# EAGLE design Adafruit USB Type C PD Switchable (EAGLE 9.6.2)
COMPANY: ADAFRUIT INDUSTRIES; DRAWN: KTOWN; REV: A; YEAR: 2019
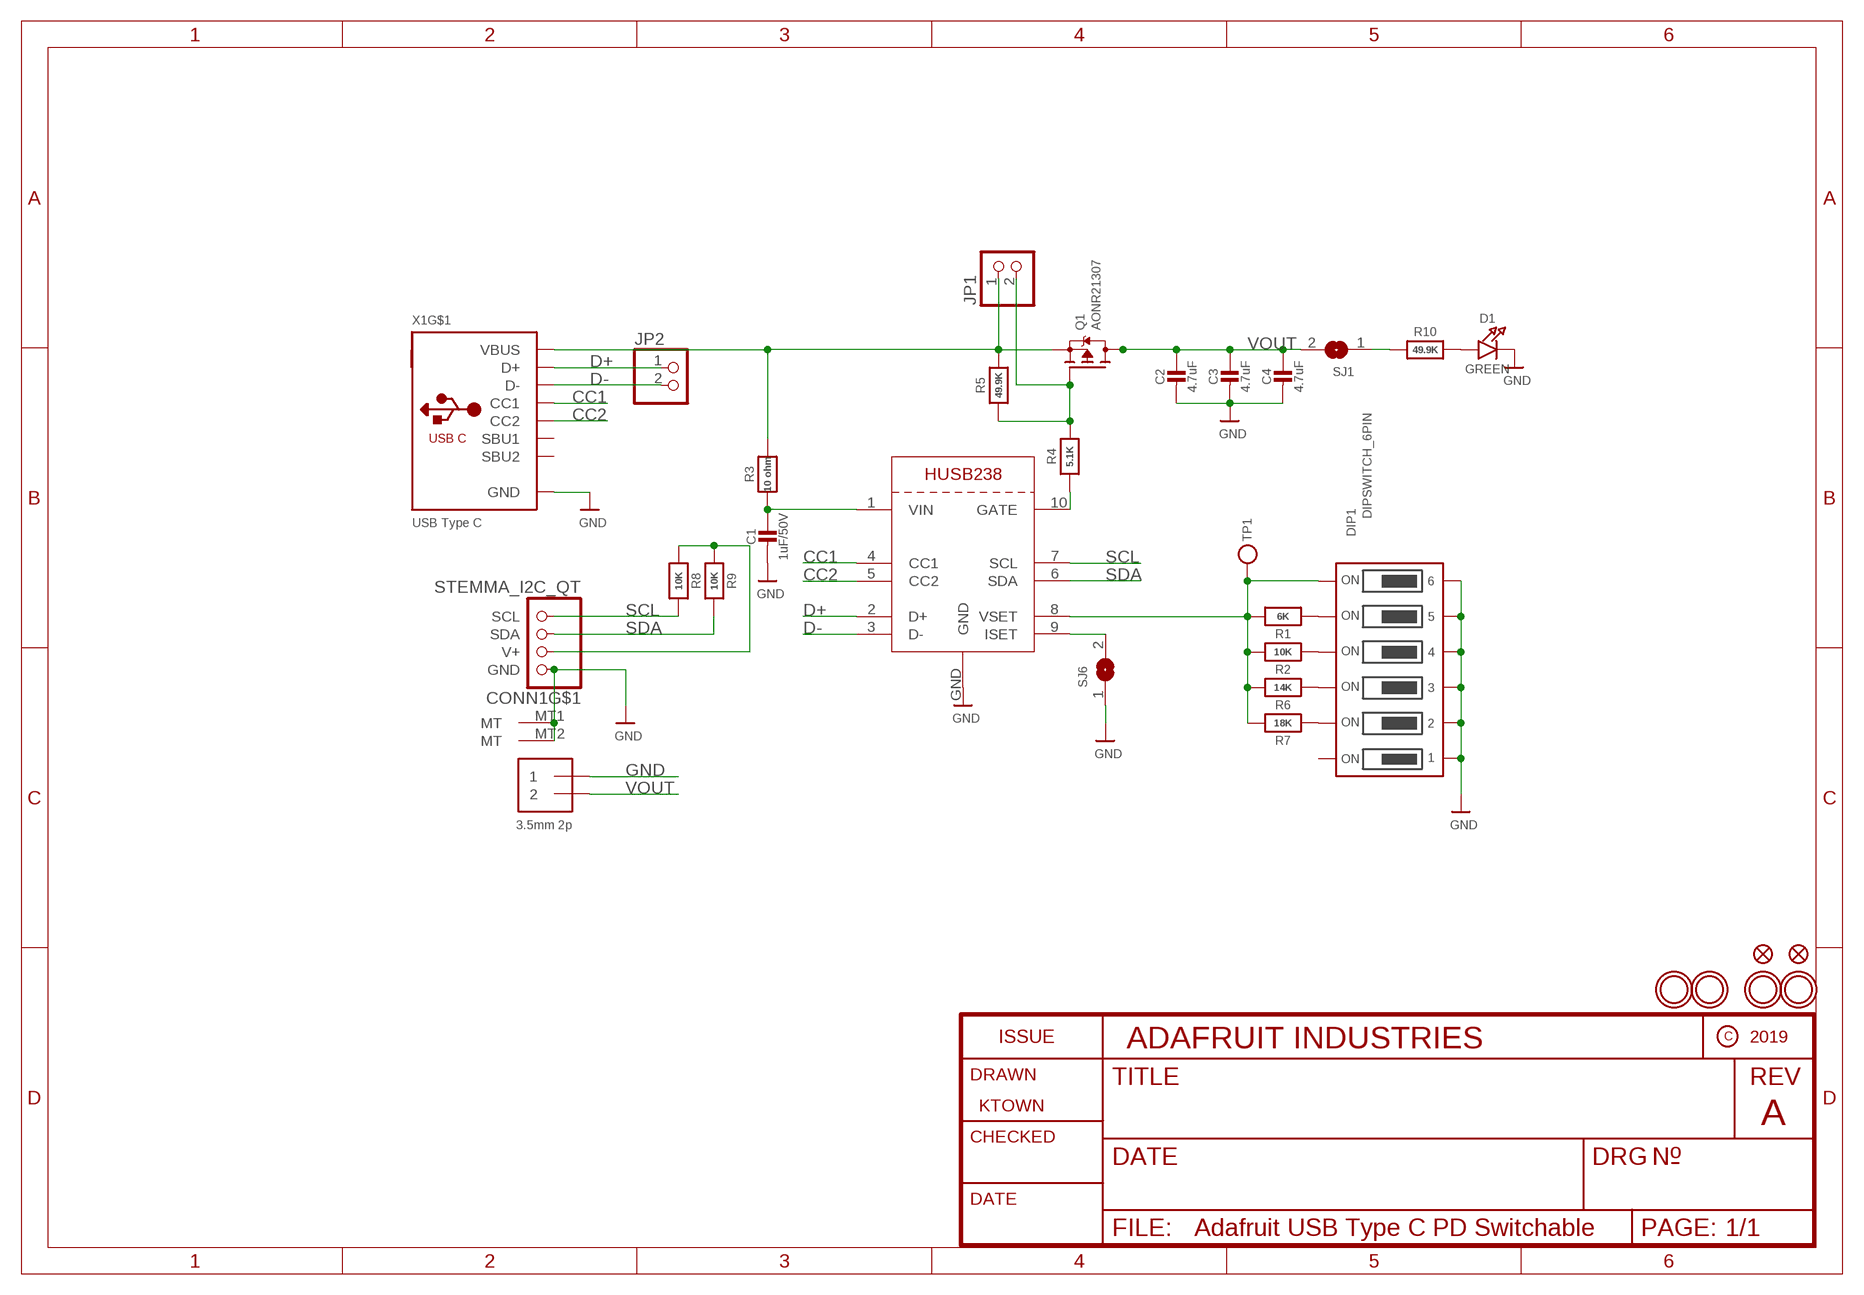
[diagram p0: schematic, sheet 1]

## Parts
C1  1uF/50V  CAP_CERAMIC0805-NOOUTLINE  [0805-NO]
C2  4.7uF  CAP_CERAMIC0805-NOOUTLINE  [0805-NO]
C3  4.7uF  CAP_CERAMIC0805-NOOUTLINE  [0805-NO]
C4  4.7uF  CAP_CERAMIC0805-NOOUTLINE  [0805-NO]
CONN1  STEMMA_I2C_QT  [JST_SH4]
D1  GREEN  LED0603_NOOUTLINE  [CHIPLED_0603_NOOUTLINE]
DIP1  DIPSWITCH_6PIN  [DIPSWITCH_6PIN_1.27]
FID1  FIDUCIAL_1MM  [FIDUCIAL_1MM]
FID2  FIDUCIAL_1MM  [FIDUCIAL_1MM]
JP1  HEADER-1X2ROUND  [1X02_ROUND]
JP2  HEADER-1X2ROUND  [1X02_ROUND]
Q1  AONR21307  MOSFET-P-POWERDI3333  [POWERDI3333]
R1  6K  RESISTOR_0402NO  [_0402NO]
R2  10K  RESISTOR_0402NO  [_0402NO]
R3  10 ohm  RESISTOR_0402NO  [_0402NO]
R4  5.1K  RESISTOR_0402NO  [_0402NO]
R5  49.9K  RESISTOR_0402NO  [_0402NO]
R6  14K  RESISTOR_0402NO  [_0402NO]
R7  18K  RESISTOR_0402NO  [_0402NO]
R8  10K  RESISTOR_0402NO  [_0402NO]
R9  10K  RESISTOR_0402NO  [_0402NO]
R10  49.9K  RESISTOR_0402NO  [_0402NO]
SJ1  SOLDERJUMPERCLOSED  [SOLDERJUMPER_CLOSEDWIRE]
SJ6  SOLDERJUMPERCLOSED  [SOLDERJUMPER_CLOSEDWIRE]
TP1  TESTPOINTROUND1.5MMNO  [TESTPOINT_ROUND_1.5MM_NO]
U$1  MOUNTINGHOLE2.5  [MOUNTINGHOLE_2.5_PLATED]
U$2  MOUNTINGHOLE2.5  [MOUNTINGHOLE_2.5_PLATED]
U$13  MOUNTINGHOLE2.5  [MOUNTINGHOLE_2.5_PLATED]
U$16  MOUNTINGHOLE2.5  [MOUNTINGHOLE_2.5_PLATED]
X1  USB Type C  USB_C  [USB_C_CUSB31-CFM2AX-01-X]
X3  HUSB238  [DFN10_3X3MM]
X4  3.5mm 2p  TERMBLOCK_1X2_3.5MM  [TERMBLOCK_1X2-3.5MM]

## Nets
CC1: X1.A5(CC1) X3.4(CC1)
CC2: X1.B5(CC2) X3.5(CC2)
D+: JP2.1 X1.A6(D+) X1.B6(D+) X3.2(D+)
D-: JP2.2 X1.A7(D-) X1.B7(D-) X3.3(D-)
GND: C1.2 C2.2 C3.2 C4.2 CONN1.1(GND) CONN1.MT1(MT) CONN1.MT2(MT) D1.C DIP1.1OFF DIP1.2OFF DIP1.3OFF DIP1.4OFF DIP1.5OFF DIP1.6OFF SJ6.1 X1.A1B12(GND) X1.B1A12(GND) X3.GND X4.1
N$1: C1.1 R3.1 X3.1(VIN)
N$2: JP1.2 Q1.4(G) R4.2 R5.2
N$3: DIP1.6ON R1.2 R2.2 R6.2 R7.2 TP1.P$1 X3.8(VSET)
N$4: R4.1 X3.10(GATE)
N$5: DIP1.5ON R1.1
N$6: DIP1.4ON R2.1
N$7: DIP1.3ON R6.1
N$8: DIP1.2ON R7.1
N$9: SJ6.2 X3.9(ISET)
N$10: CONN1.2(V+) R8.1 R9.1
N$11: R10.1 SJ1.1
N$12: D1.A R10.2
SCL: CONN1.4(SCL) R8.2 X3.7(SCL)
SDA: CONN1.3(SDA) R9.2 X3.6(SDA)
VBUS: JP1.1 Q1.1(S) Q1.2(S) Q1.3(S) R3.2 R5.1 X1.A4B9(VBUS) X1.B4A9(VBUS)
VOUT: C2.1 C3.1 C4.1 Q1.5678(D) SJ1.2 X4.2
Unconnected: DIP1.1ON X1.A8(SBU1) X1.B8(SBU2) X1.M1(MT) X1.M2(MT) X1.M3(MT) X1.M4(MT)

## Library data of the parts
C1-C4 = microbuilder:CAP_CERAMIC: Ceramic Capacitors For new designs, use the packages preceded by an '_' character since they are more reliable: The following footprints should be used on most boards: _0402 - Standard footprint for regular board layouts _0603 - Standard footprint for regular board layouts _0805 - Standard footprint for regular board layouts _1206 - Standard footprint for regular board layouts For extremely tight-pitch boards where space is at a premium, the following 'micro-pitch' footprints can be used (smaller pads, no silkscreen outline, etc.): _0402MP - Micro-pitch footprint for very dense/compact boards _0603MP - Micro-pitch footprint for very dense/compact boards _0805MP - Micro-pitch footprint for very dense/compact boards _1206MP - Micro-pitch footprint for very dense/compact boards
CONN1 = adafruit_electromech:STEMMA_I2C; LCSC: C2845363
D1 = microbuilder:LED: LED 0603 - 0603 Surface Mount Package 2mA: Green LED - Low Power (3.9mcd, 2ma, 1.7Vf) - Digikey: 475-2709-2-ND Orange LED - Low Power (9.8mcd, 2ma, 1.8Vf) - Digikey: 475-1194-2-ND Red LED - Low Power (5mcd, 2ma, 1.8Vf) - Digikey: 475-1195-2-ND Yellow LED - Low Power (7mcd, 2ma, 1.8Vf) - Digikey: 475-1196-2-ND 5mA: Blue LED - Low Power (17mcd, 5ma, 2.9Vf) - Digikey: LNJ937W8CRACT-ND 0805 - 0805 Surface Mount Package 2mA: Red LED (8.8mcd, 2mA, 1.8Vf, Clear) - Low Power [Digikey: 475-2510-1-ND] Green LED (5mcd, 2mA, 1.8Vf, Clear) - Low Power [Digikey: 475-2730-1-ND] Yellow LED (11.3mcd, 2mA, 1.8Vf, Clear) - Low Power [Digikey: 475-2555-1-ND] 20mA: Red LED (104mcd, 20mA, Diffused) - LS R976 [Digikey: 475-1278-6-ND] Red LED (12mcd, 20mA, 2.0Vf, Clear) - APT2012EC [Digikey: 754-1128-1-ND] Green LED (15mcd, 20mA, 2.2Vf, Clear) - APT2012GC [Digikey: 754-1131-1-ND] Orange LED (160mcd, 20mA, 2.1Vf, Clear) - APT2012SECK [Digikey: 754-1130-1-ND] 1206 - 1206 Surface Mount Package Green LED (26mcd, 20mA, Diffused) - LG N971 [Digikey: 475-1407-6-ND] Red LED (15mcd, 20mA, Diffused) - LH N974 [Digikey: 475-1416-6-ND] Cree - Cree High-Power Surface Mount LEDs XPEBWT-L1-0000-00D50 - White 111lm 350mA 2.9Vf 6200K 110° XTEAWT-00-0000-00000LEE3 - White 114lm 350mA 2.85Vf 5000K 115° Everlight - Everlight 45-21 Series Surface Mount LEDs 45-21/QK2C-B2832AC2CB2/2T - Warm White 2000mcd 20mA 3.25Vf 3050K 120° 45-21/LK2C-B38452C4CB2/2T - Nuetral White 2000mcd 20mA 3.25Vf 4150K 120° 45-21/LK2C-B50634C6CB2/2T - Cold White 2200mcd 20mA 3.25Vf 5650K 120° PLCC2 Reverse Mount LS T77K-J1L2-1-0-2-R18-Z - Red 11.25mcd 2mA 1.8Vf 630nm 120° LO T77K-L1M2-24-Z - Orange 19.6mcd 2mA 1.8Vf 606nm 120° LY T77K-K2M1-26-Z - Yellow 15.7mcd 2mA 1.8Vf 587nm 120°; ROT: 270
DIP1 = adafruit_electromech:DIPSWITCH_6PIN
FID1 FID2 = microbuilder:FIDUCIAL: Fiducial Alignment Points Various fiducial points for machine vision alignment.; BOM: EXCLUDE
JP1 JP2 = microbuilder:HEADER-1X2: PIN HEADER
Q1 = microbuilder:MOSFET-P: P-Channel Mosfet LEGEND VDS: Voltage Drain-Source ID: Drain Current RDS(ON): Drain-Source On-State Resistance VGS(TH): Gate-Source Threshold Voltage CISS: Drain-Source Input Capacitance SOT-23 Name VDS ID RDS(ON) VGS(TH) CISS Order Number IRLML5103 30V 760mA 600 mOhm -- 75pF @ 25V Digikey: IRLML5103PBFCT-ND IRLML6401 12V 4.3A 50 mOhm 950mV @ 250µA 830pF @ 10V Digikey: IRLML6401PBFTR-ND NTR0202PL 20V 400mA 800 mOhm 2.3V @ 250uA 70pF @ 5V Digikey: NTR0202PLT1GOSTR-ND NTR4101PT1G 20V 1.8A 85 mOhm 1.2V @ 250uA 675pF @ 10V Digikey: NTR4101PT1GOSCT-ND DMP2004K 20V 600mA 900 mOhm 1V @ 250uA 175pF @ 16V Digikey: DMP2004KDICT-ND PMV65XP 20V 3.9A 76 mOhm 950mV @ 1mA 725pF @ 20V Digikey: 568-2358-2-ND TO-252 Name VDS ID RDS(ON) VGS(TH) CISS Order Number AOD417 30V 25A 34 mOhm 3V @ 250µA 920pF @ 15V Digikey: 785-1106-2-ND PowerPak Name VDS ID RDS(ON) VGS(TH) CISS Order Number AON7401 30V 12A 14 mOhm 3V @ 250µA 2600pF @ 15V Digikey: 785-1302-1-ND; ROT: 270
R1-R10 = microbuilder:RESISTOR: Resistors For new designs, use the packages preceded by an '_' character since they are more reliable: The following footprints should be used on most boards: _0402 - Standard footprint for regular board layouts _0603 - Standard footprint for regular board layouts _0805 - Standard footprint for regular board layouts _1206 - Standard footprint for regular board layouts For extremely tight-pitch boards where space is at a premium, the following 'micro-pitch' footprints can be used (smaller pads, no silkscreen outline, etc.): _0402MP - Micro-pitch footprint for very dense/compact boards _0603MP - Micro-pitch footprint for very dense/compact boards _0805MP - Micro-pitch footprint for very dense/compact boards _1206MP - Micro-pitch footprint for very dense/compact boards
SJ1 SJ6 = microbuilder:SOLDERJUMPER: SMD Solder JUMPER Solder the two pads together to create a connection, or remove the solder to break it. REFLOW - Use this footprint for solder paste and reflow ovens. WAVE - Use this footprint for hand-soldering (larger pads). CLOSED - Has a trace between the two pads to ensure it is closed by default. The trace needs to be cut to disable the jumper, and can be closed again by creating a solder bridge between the two pads.
TP1 = microbuilder:TESTPOINT: Test Point Various test points for characterisation and PCB testing TESTPOINT_SMT - Compact Surface Mount Test Point [Digikey: 5016KTR-ND]
U$1 U$2 U$13 U$16 = adafruit_electromech:MOUNTINGHOLE: Mounting Hole For #2 screws (0.086"/2.18mm width, 0.094"/2.4mm hole) use 2.5mm; BOM: EXCLUDE
X1 = adafruit_electromech:USB_C: USB Type-C USB 2.0 Connector; LCSC: C165948
X3 = adafruit_power:HUSB238
X4 = adafruit_electromech:TERMBLOCK_1X2: 3.5mm Terminal block http://www.ladyada.net/library/pcb/eaglelibrary.html; ROT: 0

## Board
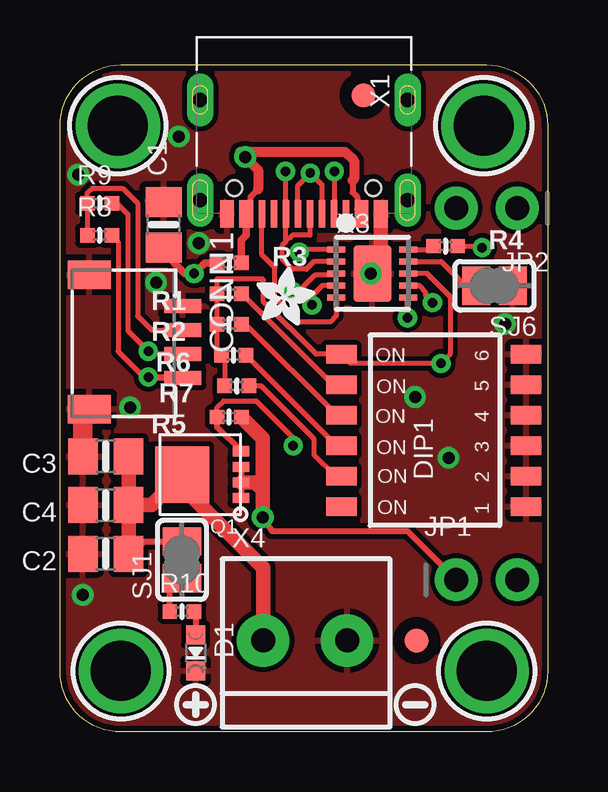
[diagram p1: board, top side]
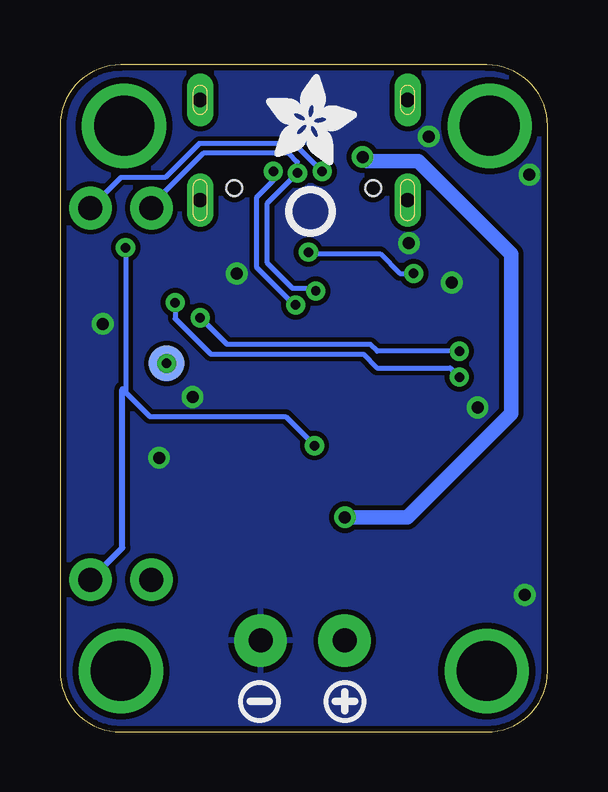
[diagram p2: board, bottom side, seen from below]

Size 20.32 x 27.81 mm. Coordinates in mm from the lower left corner, seen from the top.
Outline: 20.32,25.27 20.32,2.54 arc-90 17.78,0 2.54,0 arc-90 0,2.54 0,25.27 arc-90 2.54,27.81 17.78,27.81 arc-90 20.32,25.27
Copper layers (1*16): Top 0.035mm / dielectric 1.5mm / Bottom 0.035mm
Design rules "adafruit": minimum track width 8mil, minimum drill 15.5mil, track to track 8mil, track to pad 8mil, pad to pad 8mil, via to via 8mil, smd to smd 8mil, copper to edge 10mil, drill to drill 8mil, minimum pad ring 10mil, minimum via ring 8mil, stop-mask expansion 2mil, vias tented up to drill 20mil, thermal gap 10mil

### Footprints (pad centres in the part's own frame; a part is rotated, then mirrored left to right if it is on the bottom)
0805-NO = smd 1.24 x 1.5: 1 -0.95,0; 2 0.95,0
JST_SH4 = smd 0.6 x 1.55: 1 -1.5,2.006; 2 -0.5,2.006; 3 0.5,2.006; 4 1.5,2.006 | smd 1.2 x 1.8: MT1 -2.8,-1.894; MT2 2.8,-1.894
CHIPLED_0603_NOOUTLINE = smd 0.8 x 0.8: A 0,-0.75; C 0,0.75
DIPSWITCH_6PIN_1.27 = smd 0.76 x 1.27: 1OFF -3.175,-3.8; 1ON -3.175,3.9; 2OFF -1.905,-3.8; 2ON -1.905,3.9; 3OFF -0.635,-3.8; 3ON -0.635,3.9; 4OFF 0.635,-3.8; 4ON 0.635,3.9; 5OFF 1.905,-3.8; 5ON 1.905,3.9; 6OFF 3.175,-3.8; 6ON 3.175,3.9
FIDUCIAL_1MM = smd 1 x 1: 1 0,0
1X02_ROUND = drill 1 pad 1.778: 1 -1.27,0; 2 1.27,0
POWERDI3333 = smd 0.7 x 0.42: 1 -1.446,0.975; 2 -1.446,0.325; 3 -1.446,-0.325; 4 -1.446,-0.975 | smd 2.25 x 2.35: 5678 1.004,0
_0402NO = smd 0.6 x 0.6: 1 -0.508,0; 2 0.508,0
SOLDERJUMPER_CLOSEDWIRE = smd 1.168 x 1.6: 1 -0.762,0; 2 0.762,0 | smd 0.635 x 0.203: WIRE 0,0
TESTPOINT_ROUND_1.5MM_NO = smd 1.5 x 1.5: P$1 0,0
MOUNTINGHOLE_2.5_PLATED = drill 2.5 pad 3.2: P$1 0,0
USB_C_CUSB31-CFM2AX-01-X = smd 0.575 x 1.15: A1B12 -3.2,2.275; A4B9 -2.4,2.275; B1A12 3.2,2.275; B4A9 2.4,2.275 | smd 0.275 x 1.15: A5 -1.25,2.275; A6 -0.25,2.275; A7 0.25,2.275; A8 1.25,2.275; B5 1.75,2.275; B6 0.75,2.275; B7 -0.75,2.275; B8 -1.75,2.275 | drill 0.6 pad 1 long: M1 -4.32,1.7; M2 4.32,1.7; M3 -4.32,-2.48; M4 4.32,-2.48 | hole 0.65: 2.89,1.2; -2.89,1.2
DFN10_3X3MM = smd 0.25 x 0.8: 1 -1,-1.5; 2 -0.5,-1.5; 3 0,-1.5; 4 0.5,-1.5; 5 1,-1.5; 6 1,1.5; 7 0.5,1.5; 8 0,1.5; 9 -0.5,1.5; 10 -1,1.5 | smd 2.35 x 1.58: GND 0,0
TERMBLOCK_1X2-3.5MM = drill 1 pad 2.184: 1 1.8,0; 2 -1.7,0

### Placement (x,y rotation side)
C1  4.32,21.15 90 top
C2  1.91,7.43 180 top
C3  1.91,11.49 180 top
C4  1.91,9.46 180 top
CONN1  3.11,16.26 270 top
D1  5.65,3.3 180 top
DIP1  15.62,12.57 90 top
FID1  14.86,3.81 180 top
FID2  12.64,26.54 180 top
JP1  17.78,6.35 0 top
JP2  17.78,21.84 180 top
PLABEL0  [PLABEL0]  10.92,9.4 0 top
PLABEL1  [PLABEL1]  10.92,10.67 0 top
PLABEL2  [PLABEL2]  10.92,12 0 top
PLABEL3  [PLABEL3]  10.92,13.21 0 top
PLABEL4  [PLABEL4]  10.92,14.48 0 top
PLABEL5  [PLABEL5]  10.92,15.75 0 top
PLABEL6  [PLABEL6]  14.73,6.48 90 top
PLABEL7  [PLABEL7]  2.67,5.84 0 top
PLABEL8  [PLABEL8]  18.92,20.32 0 top
PLABEL9  [PLABEL9]  10.54,10.29 0 bottom
PLABEL10  [PLABEL10]  10.16,16.64 0 bottom
PLABEL11  [PLABEL11]  10.16,5.97 0 bottom
PLABEL12  [PLABEL12]  19.05,23.24 0 bottom
PLABEL13  [PLABEL13]  15.75,23.37 0 bottom
Q1  6.1,10.73 180 top
R1  7.05,18.28 180 top
R2  7.05,16.99 180 top
R3  7.05,19.56 0 top
R4  16.07,20.26 0 top
R5  7.05,13.13 180 top
R6  7.24,15.71 180 top
R7  7.37,14.43 180 top
R8  1.65,20.7 0 top
R9  1.65,22.03 0 top
R10  5.08,5.02 0 top
SJ1  5.08,7.18 90 top
SJ6  18.1,18.61 180 top
TP1  15.88,15.37 0 bottom
U$1  17.65,25.27 180 top
U$2  2.41,25.27 180 top
U$3  [ADAFRUIT_2.5MM]  8.19,16.95 0 top
U$7  [SYMBOL_PLUS]  5.65,1.14 0 top
U$8  [PCBFEAT-REV-040]  9.88,21.7 180 bottom
U$9  [ADAFRUIT_3.5MM]  11.75,23.62 0 bottom
U$13  2.54,2.54 0 top
U$14  [SYMBOL_MINUS]  14.8,1.14 0 top
U$16  17.78,2.54 0 top
U$18  [SYMBOL_MINUS]  12,1.27 0 bottom
U$19  [SYMBOL_PLUS]  8.45,1.27 0 bottom
X1  10.16,23.88 180 top
X3  13.02,19.11 270 top
X4  10.16,3.81 0 top

### Tracks (layer width: path | path; a pad name or v marks a point on that pad's centre or on a via)
CC1  (via drill 0.39)
  Top 0.203: X3.4 10.93,18.61 10.5,18.18 v10.5,17.8 | v11.43,23.37 11.43,21.62 X1.A5
  Bottom 0.203: v10.5,17.8 10.56,17.8 12.12,19.35 12.12,22.3 11.43,22.99 v11.43,23.37
CC2
  Top 0.203: X3.5 11.52,17.35 11.26,17.1 9.95,17.1 8.95,18.1 8.95,19.37 8.41,19.91 X1.B5
D+  (via drill 0.39)
  Top 0.203: X3.2 10.58,19.61 10.26,19.3 9.68,19.3 9.27,19.71 9.27,20.29 9.41,20.44 9.41,20.57 | 9.41,20.57 X1.B6 9.41,23.36 v9.4,23.37 | X1.A6 10.41,20.71 9.68,20.71 9.54,20.57 9.41,20.57
  Bottom 0.203: v9.4,23.37 10.57,24.54 14.52,24.54 15.94,23.11 17.78,23.11 JP2.1
D-  (via drill 0.39)
  Top 0.203: X3.3 11.45,19.04 10.62,19.04 9.96,18.39 v9.66,18.39 | X1.B7 10.91,22.82 v10.43,23.3 9.91,22.79 X1.A7
  Bottom 0.203: v9.66,18.39 9.79,18.51 10.63,18.51 11.68,19.56 11.68,22.05 v10.43,23.3 10.43,23.76 10.79,24.13 14.35,24.13 16.64,21.84 JP2.2
GND  (via drill 0.5)
  Top 0.61: X1.A1B12 13.36,19.46 X3.GND
  Top 0.813: C3.2 0.95,13.19 CONN1.MT2
  other vias: 2.92,13.53 4,18.73 5.78,20.38 12.95,19.11 14.8,13.97 16.19,11.43 0.95,5.71 4.95,24.83 0.76,23.24 18.54,17.02
  pour Top: 0,27.81 20.32,27.81 20.32,0 0,0
  pour Bottom: 0,27.81 20.32,27.81 20.32,0 0,0
N$1  (via drill 0.39)
  Top 0.203: X3.1 10.08,20.11 v9.97,20
  Top 0.305: C1.1 4.32,20 5.21,19.12 v5.58,19.12 6.03,19.56 R3.1
  Bottom 0.203: v9.97,20 9.91,19.94 6.98,19.94 6.16,19.12 v5.58,19.12
N$2  (via drill 0.39)
  Top 0.203: R4.2 17.53,20.26 v17.59,20.19 | R5.2 6.54,13.53 6.82,13.8 8.17,13.8 9.72,12.26 v9.72,11.94
  Top 0.254: R5.2 6.54,12.71 Q1.4
  Bottom 0.203: v17.59,20.19 17.59,14.16 | 17.72,14.29 17.59,14.16 | 17.59,14.16 16.57,13.14 10.92,13.14 v9.72,11.94
  Bottom 0.254: JP1.2 17.72,7.68 17.72,14.29
N$3  (via drill 0.39)
  Top 0.203: R7.2 6.86,15.58 R6.2 6.54,15.9 R2.2 R1.2 6.54,18.89 8.43,18.89 8.48,18.84 8.48,17.94 10.67,15.75 DIP1.6ON 12.1,15.37 TP1.P$1 16.26,15.75 16.26,18.16 15.3,19.11 X3.8
  other vias: 15.88,15.37
N$4
  Top 0.203: X3.10 15.41,20.11 R4.1
N$5
  Top 0.203: R1.1 11.37,14.48 DIP1.5ON
N$6
  Top 0.203: DIP1.4ON 11.53,13.21 7.75,16.99 R2.1
N$7
  Top 0.203: R6.1 11.52,11.94 DIP1.3ON
N$8
  Top 0.203: R7.1 8.38,14.43 10.58,12.23 10.58,11.56 11.47,10.67 DIP1.2ON
N$9
  Top 0.203: X3.9 15.88,19.61 16.89,18.61 SJ6.2
N$10
  Top 0.203: R8.1 R9.1 1.14,22.48 1.33,22.67 2.61,22.67 3.23,22.04 3.23,17.34 3.82,16.76 CONN1.2
N$11
  Top 0.254: R10.1 4.57,5.91 SJ1.1
N$12
  Top 0.254: R10.2 5.65,4.95 D1.A
SCL  (via drill 0.39)
  Top 0.203: v15.52,17.9 15.22,18.2 15.22,18.35 14.96,18.61 X3.7 | R8.2 2.42,20.44 2.42,15.87 3.53,14.76 CONN1.4 5.08,14.8 v3.68,14.8
  Bottom 0.203: v15.52,17.9 15.52,17.23 14.03,15.75 7.68,15.75 7.11,15.18 4.06,15.18 v3.68,14.8
SDA  (via drill 0.39)
  Top 0.203: R9.2 2.38,22.04 2.83,21.59 2.83,16.73 v3.68,15.88 3.8,15.76 CONN1.3 | v14.48,17.27 14.48,18.07 X3.6
  Bottom 0.203: v3.68,15.88 7.11,15.88 7.39,16.15 13.36,16.15 v14.48,17.27
VBUS  (via drill 0.5)
  Top 0.254: Q1.3 Q1.2 Q1.1 | X1.B4A9 7.94,21.78 7.94,22.31 8.26,22.62 | 12.19,22.99 12.19,22.5 12.38,22.31 12.38,21.78 X1.A4B9 | 8.14,10.41 8.31,10.41 8.31,9.09 8.84,8.38 14.48,8.38 JP1.1
  Top 0.305: X1.B4A9 7.76,20.71 7.56,20.51 R3.2
  Top 0.406: 8.26,22.62 8.26,23.43 v7.71,23.97 7.49,24.19 11.87,24.19 12.26,23.81 12.26,23.05 12.19,22.99
  Top 0.61: R5.1 8.45,12.24 v8.45,8.95 8.45,9.4 8.45,10.09 8.14,10.41 | 8.31,10.41 Q1.2
  Bottom 0.61: v8.45,8.95 5.84,8.95 1.52,13.27 1.52,19.92 5.4,23.79 7.54,23.79 v7.71,23.97
VOUT
  Top 0.254: C2.1 3.05,7.62 3.2,7.62 3.52,7.94 SJ1.2
  Top 0.61: C3.1 C4.1 | C4.1 C2.1 | C4.1 3.82,9.46 Q1.5678 5.09,10.21 8.46,6.84 X4.2

### Text on the board
Pinguin_tBackup: ISet | open | 3A | 2A | HUSB238 | 5V | 5V | 9V | 9V | 12V | 15V | 12V | 1A | 18V | 20V | 15V | 18V | LED | OFF | 20V | open | SDA | SCL | V+ | GND | D- | D+
Pinguin_bBackup: D- | D+ | HUSB238 | HUSB238 USB C / Power Delivery / Selectable Output | USB Type C PD Sink / 5/9/12/15/18/20V / Select jumpers or use / I2C addr 0x08 to config | Disconnect load before / switching voltages! Check / with voltmeter to verify! | UP TO 20V!!!